# Altium project PontenH.PrjPcb
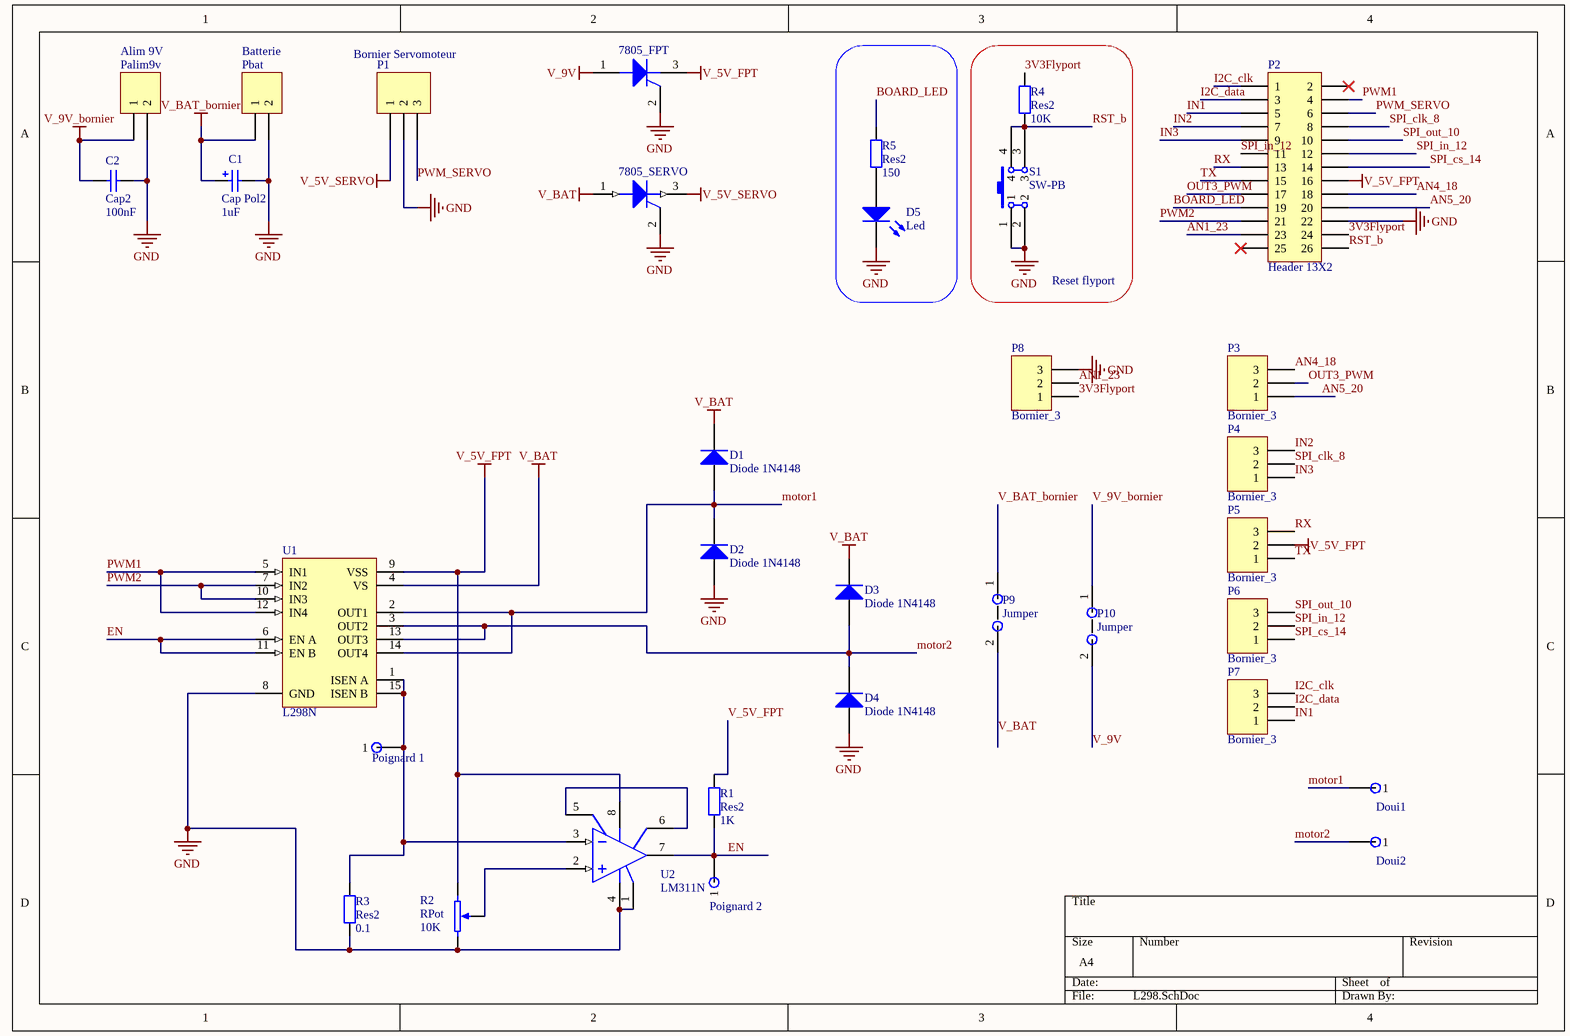
[diagram p0: L298.SchDoc]
1 sheet, 33 parts. Net scope: global (net labels, ports and power ports of the same name join across sheets).
Board file: PonEnH.PcbDoc

## Sheet L298.SchDoc
size A4

### Parts
7805_FPT  SCR  [TO-220-AB]  (value not drawn)
7805_SERVO  SCR  [TO-220-AB]  (value not drawn)
C1  Cap Pol2  value 1uF  [Capa2_pol]
C2  Cap2  value 100nF  [CAPA2]
D1  Diode 1N4148  [Ddiode]
D2  Diode 1N4148  [Ddiode]
D3  Diode 1N4148  [Ddiode]
D4  Diode 1N4148  [Ddiode]
D5  Led  [LED]
Doui1  douille_2mm  [Douille-2mm]  (value not drawn)
Doui2  douille_2mm  [Douille-2mm]  (value not drawn)
P1  Bornier Servomoteur  [Bornier_3]
P2  Header 13X2  [HDR2X13]
P3  Bornier_3  [Bornier_3]
P4  Bornier_3  [Bornier_3]
P5  Bornier_3  [Bornier_3]
P6  Bornier_3  [Bornier_3]
P7  Bornier_3  [Bornier_3]
P8  Bornier_3  [Bornier_3]
P9  Jumper  [picot2]
P10  Jumper  [picot2]
Palim9v  Alim 9V  [Bornier_2]
Pbat  Batterie  [Bornier_2]
Poignard_1  Poignard  [Poignard]  (value not drawn)
Poignard_2  Poignard  [Poignard]  (value not drawn)
R1  Res2  value 1K  [res5_1/4W]
R2  RPot  value 10K  [AJUSTABLE]
R3  Res2  value 0.1  [res5_1/4W]
R4  Res2  value 10K  [res5_1/4W]
R5  Res2  value 150  [res5_1/4W]
S1  SW-PB  [SW_BP]
U1  L298N  [Multiwatt15V]
U2  LM311N  [DIP8]

### Blocks framed on the sheet
Reset flyport: R4 S1

### Nets
GND: 7805_FPT.2(GND) 7805_SERVO.2(GND) C1.2 C2.2 D2.1(A) D4.1(A) D5.2(K) P1.2 P2.22 P8.3 Palim9v.2 Pbat.2 R2.3(TOP) R3.2 S1.1 S1.2 U1.8(GND) U2.1(GND) U2.4(V-_(CASE))
V_5V_FPT: 7805_FPT.3(OUT) P2.16 P5.2 R1.2 R2.1(BOT) U1.9(VSS) U2.8(V+)
V_5V_SERVO: 7805_SERVO.3(OUT) P1.1
V_9V: 7805_FPT.1(IN) P10.2
V_9V_bornier: C2.1 P10.1 Palim9v.1
V_BAT: 7805_SERVO.1(IN) D1.2(K) D3.2(K) P9.2 U1.4(VS)
V_BAT_bornier: C1.1 P9.1 Pbat.1
3V3Flyport: P2.24 P8.1 R4.1
AN1_23: P2.23 P8.2
AN4_18: P2.18 P3.3
AN5_20: P2.20 P3.1
BOARD_LED: P2.19 R5.1
EN: Poignard_2.1 R1.1 U1.6(EN_A) U1.11(EN_B) U2.7(OUT)
I2C_clk: P2.1 P7.3
I2C_data: P2.3 P7.2
IN1: P2.5 P7.1
IN2: P2.7 P4.3
IN3: P2.9 P4.1
motor1: D1.1(A) D2.2(K) Doui1.1 U1.2(OUT1) U1.14(OUT4)
motor2: D3.1(A) D4.2(K) Doui2.1 U1.3(OUT2) U1.13(OUT3)
OUT3_PWM: P2.17 P3.2
PWM1: P2.4 U1.5(IN1) U1.12(IN4)
PWM2: P2.21 U1.7(IN2) U1.10(IN3)
PWM_SERVO: P1.3 P2.6
RST_b: P2.26 R4.2 S1.3 S1.4
RX: P2.13 P5.3
SPI_clk_8: P2.8 P4.2
SPI_cs_14: P2.14 P6.1
SPI_in_12: P2.11 P2.12 P6.2
SPI_out_10: P2.10 P6.3
TX: P2.15 P5.1
NetD5_1: D5.1(A) R5.2
NetPoignard_1_1: Poignard_1.1 R3.1 U1.1(ISEN_A) U1.15(ISEN_B) U2.3(IN-)
NetR2_2: R2.2(TAP) U2.2(IN+)
NetU2_5: U2.5(BAL) U2.6(BAL/STB)

Not connected (* = marked no-connect by the designer): P2 2* 25*

### Library data of the parts
7805_FPT 7805_SERVO = SCR: Silicon Controlled Rectifier; Published: 8-Jun-2000; LatestRevisionDate: 17-Jul-2002; LatestRevisionNote: Re-released for DXP Platform.; PackageReference: TO-220-AB; Publisher: Altium Limited; Code_JEDEC: TO-220-AB
C1 = Cap Pol2: Polarized Capacitor (Radial); Published: 8-Jun-2000; LatestRevisionDate: 17-Jul-2002; LatestRevisionNote: Re-released for DXP Platform.; PackageReference: RB7.6-15; Publisher: Altium Limited
C2 = Cap2: Capacitor; Published: 8-Jun-2000; LatestRevisionDate: 17-Jul-2002; LatestRevisionNote: Re-released for DXP Platform.; PackageReference: RAD-0.3; Publisher: Altium Limited
D1-D4 = Diode 1N4148: High Conductance Fast Diode; pin to pad: 1>A 2>K; Published: 8-Jun-2000; LatestRevisionDate: 17-Jul-2002; LatestRevisionNote: Re-released for DXP Platform.; DatasheetDocument: 1997; PackageReference: DO-35; Publisher: Altium Limited; Code_JEDEC: DO-204-AH; ComponentLink1Description: Manufacturer Link; ComponentLink1URL: http://www.fairchildsemi.com/; ComponentLink2Description: Datasheet; ComponentLink2URL: http://www.fairchildsemi.com/ds/1N%2F1N4148.pdf
Doui1 Doui2 = douille_2mm: 1-Pin; LatestRevisionDate: 17-Jul-2002; LatestRevisionNote: Re-released for DXP Platform.; Publisher: Altium Limited
P1 P3-P8 = Bornier_3: Header, 3-Pin; LatestRevisionDate: 17-Jul-2002; LatestRevisionNote: Re-released for DXP Platform.; Publisher: Altium Limited
P2 = Header 13X2: Header, 13-Pin, Dual row; LatestRevisionDate: 17-Jul-2002; LatestRevisionNote: Re-released for DXP Platform.; Publisher: Altium Limited
Palim9v Pbat = Bornier_2: Header, 2-Pin; LatestRevisionDate: 17-Jul-2002; LatestRevisionNote: Re-released for DXP Platform.; Publisher: Altium Limited
R1 R3-R5 = Res2: Resistor; Published: 8-Jun-2000; LatestRevisionDate: 17-Jul-2002; LatestRevisionNote: Re-released for DXP Platform.; PackageReference: AXIAL-0.4; Publisher: Altium Limited
R2 = RPot: Potentiometer; Sim Note: Enter the Resistance value and the set point into parameter fields.; Set Position: 0.5; Published: 8-Jun-2000; LatestRevisionDate: 17-Jul-2002; LatestRevisionNote: Re-released for DXP Platform.; PackageReference: VR5; Publisher: Altium Limited
S1 = SW-PB: Switch; Published: 24-Mar-1999; LatestRevisionDate: 17-Jul-2002; LatestRevisionNote: Re-released for DXP Platform.; PackageReference: SPST-2; Publisher: Altium Limited
U1 = L298N: Dual Full Bridge Driver; Published: 8-Jun-2000; LatestRevisionDate: 14-May-2007; LatestRevisionNote: Mapped to vertical PCB.; DatasheetVersion: Jul-1999; PackageReference: Multiwatt15V; Publisher: Altium Limited; PackageDescription: TO, Thru-Hole, Vertical, Heatsink Mounted; 15 Bent Staggered Leads; Pitch 1.27 mm; ComponentLink1Description: Manufacturer Link; ComponentLink1URL: http://www.st.com/; ComponentLink2Description: Datasheet; ComponentLink2URL: http://www.st.com/stonline/products/literature/ds/1773/l298.pdf
U2 = LM311N: Voltage Comparator; Published: 24-Aug-2001; LatestRevisionDate: 06-Jun-2005; LatestRevisionNote: Stylized 3D Model Added.; DatasheetVersion: Oct-1997; PackageReference: DIP8; Publisher: Altium Limited; PackageDescription: DIP; 8 Leads; Row Spacing 7.62 mm; Pitch 2.54 mm; Code_JEDEC: MO-001-AN; ComponentLink1Description: Manufacturer Link; ComponentLink1URL: http://www.st.com/; ComponentLink2Description: Datasheet; ComponentLink2URL: http://www.st.com/stonline/products/literature/ds/4848/lm211.pdf
D5 = Led: Published: 8-Jun-2000; LatestRevisionDate: 17-Jul-2002; LatestRevisionNote: Re-released for DXP Platform.; DatasheetDocument: 1998; PackageDocument: Aug-1999; PackageReference: DO-41; Publisher: Altium Limited; Code_JEDEC: DO-204-AL; ComponentLink1Description: Manufacturer Link; ComponentLink1URL: http://www.fairchildsemi.com/; ComponentLink2Description: Datasheet; ComponentLink2URL: http://www.fairchildsemi.com/ds/1N%2F1N4001.pdf
P9 P10 = Jumper: LatestRevisionDate: 17-Jul-2002; LatestRevisionNote: Re-released for DXP Platform.; Publisher: Altium Limited
Poignard_1 Poignard_2 = Poignard: LatestRevisionDate: 17-Jul-2002; LatestRevisionNote: Re-released for DXP Platform.; Publisher: Altium Limited